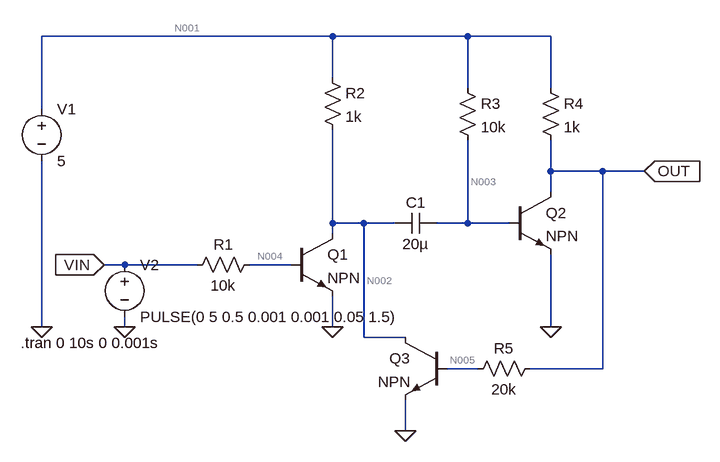
[diagram p0: schematic schemat2.asc]
schemat2.asc, the LTspice schematic file:
Version 4
SHEET 1 880 680
WIRE 112 16 -336 16
WIRE 320 16 112 16
WIRE 448 16 320 16
WIRE 112 80 112 16
WIRE 320 96 320 16
WIRE 448 96 448 16
WIRE -336 128 -336 16
WIRE 448 224 448 176
WIRE 528 224 448 224
WIRE 592 224 528 224
WIRE 448 256 448 224
WIRE 112 304 112 160
WIRE 160 304 112 304
WIRE 208 304 160 304
WIRE 320 304 320 176
WIRE 320 304 272 304
WIRE 384 304 320 304
WIRE 112 320 112 304
WIRE -208 368 -240 368
WIRE -96 368 -208 368
WIRE 48 368 -16 368
WIRE -336 464 -336 208
WIRE -208 464 -208 448
WIRE 112 464 112 416
WIRE 448 464 448 352
WIRE 160 480 160 304
WIRE 224 480 160 480
WIRE 336 528 288 528
WIRE 528 528 528 224
WIRE 528 528 416 528
WIRE 224 624 224 576
FLAG 592 224 OUT
IOPIN 592 224 In
FLAG -208 464 0
FLAG -336 464 0
FLAG 112 464 0
FLAG 448 464 0
FLAG 224 624 0
FLAG -240 368 VIN
IOPIN -240 368 In
SYMBOL voltage -336 112 R0
WINDOW 123 0 0 Left 0
WINDOW 39 0 0 Left 0
SYMATTR InstName V1
SYMATTR Value 5
SYMBOL res 96 64 R0
SYMATTR InstName R2
SYMATTR Value 1k
SYMBOL res 432 80 R0
SYMATTR InstName R4
SYMATTR Value 1k
SYMBOL npn 48 320 R0
SYMATTR InstName Q1
SYMBOL npn 384 256 R0
SYMATTR InstName Q2
SYMBOL cap 272 288 R90
WINDOW 0 0 32 VBottom 2
WINDOW 3 32 32 VTop 2
SYMATTR InstName C1
SYMATTR Value 20µ
SYMBOL res 0 352 R90
WINDOW 0 0 56 VBottom 2
WINDOW 3 32 56 VTop 2
SYMATTR InstName R1
SYMATTR Value 10k
SYMBOL res 304 80 R0
SYMATTR InstName R3
SYMATTR Value 10k
SYMBOL voltage -208 352 R0
WINDOW 123 0 0 Left 0
WINDOW 39 0 0 Left 0
SYMATTR InstName V2
SYMATTR Value PULSE(0 5 0.5 0.001 0.001 0.05 1.5)
SYMBOL res 320 544 R270
WINDOW 0 32 56 VTop 2
WINDOW 3 0 56 VBottom 2
SYMATTR InstName R5
SYMATTR Value 20k
SYMBOL npn 288 480 M0
SYMATTR InstName Q3
TEXT -368 488 Left 2 !.tran 0 10s 0 0.001s

The netlist it stands for:
* schemat2.asc
V1 N001 0 5
R2 N001 N002 1k
R4 N001 OUT 1k
Q1 N002 N004 0 0 NPN
Q2 OUT N003 0 0 NPN
C1 N003 N002 20µ
R1 N004 VIN 10k
R3 N001 N003 10k
V2 VIN 0 PULSE(0 5 0.5 0.001 0.001 0.05 1.5)
R5 N005 OUT 20k
Q3 N002 N005 0 0 NPN
.model NPN NPN
.model PNP PNP
.lib standard.bjt
.tran 0 10s 0 0.001s
.backanno
.end

* Results of the author's LTspice run, read from the files saved beside the schematic
* Operating Point, zero values left out:
*   V(n001) = 5 V
*   V(n002) = 5 V
*   V(out) = 71.11 mV
*   V(n004) = 50 nV
*   V(n003) = 819 mV
*   V(n005) = 71.11 mV
*   Ic(Q1) = 5 pA
*   Ib(Q1) = -5 pA
*   Ic(Q2) = 4.929 mA
*   Ib(Q2) = 418.1 µA
*   Ie(Q2) = -5.347 mA
*   Ic(Q3) = 4.931 pA
*   Ib(Q3) = -4.858 pA
*   I(R2) = 9.931 pA
*   I(R4) = 4.929 mA
*   I(R1) = 5 pA
*   I(R3) = 418.1 µA
*   I(R5) = 4.858 pA
*   I(V1) = -5.347 mA
*   I(V2) = 5 pA
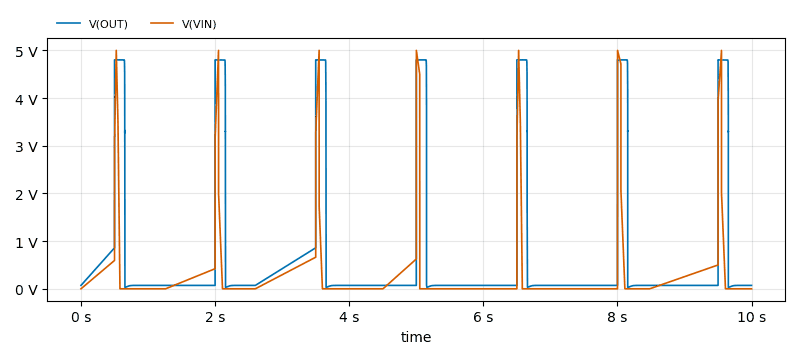
[diagram p1: Transient Analysis of schemat2.asc, plotted from the saved traces]
* Transient Analysis, 1 run:
*   V(OUT): min 28.21 mV, max 4.801 V, average 574.4 mV, rms 1.568 V, last 71.11 mV
*   V(VIN): min 0 V, max 5 V, average 178.5 mV, rms 941.8 mV, last 0 V